# EAGLE schematic usb_tester (EAGLE 6.3)
TITLE: USB TESTER
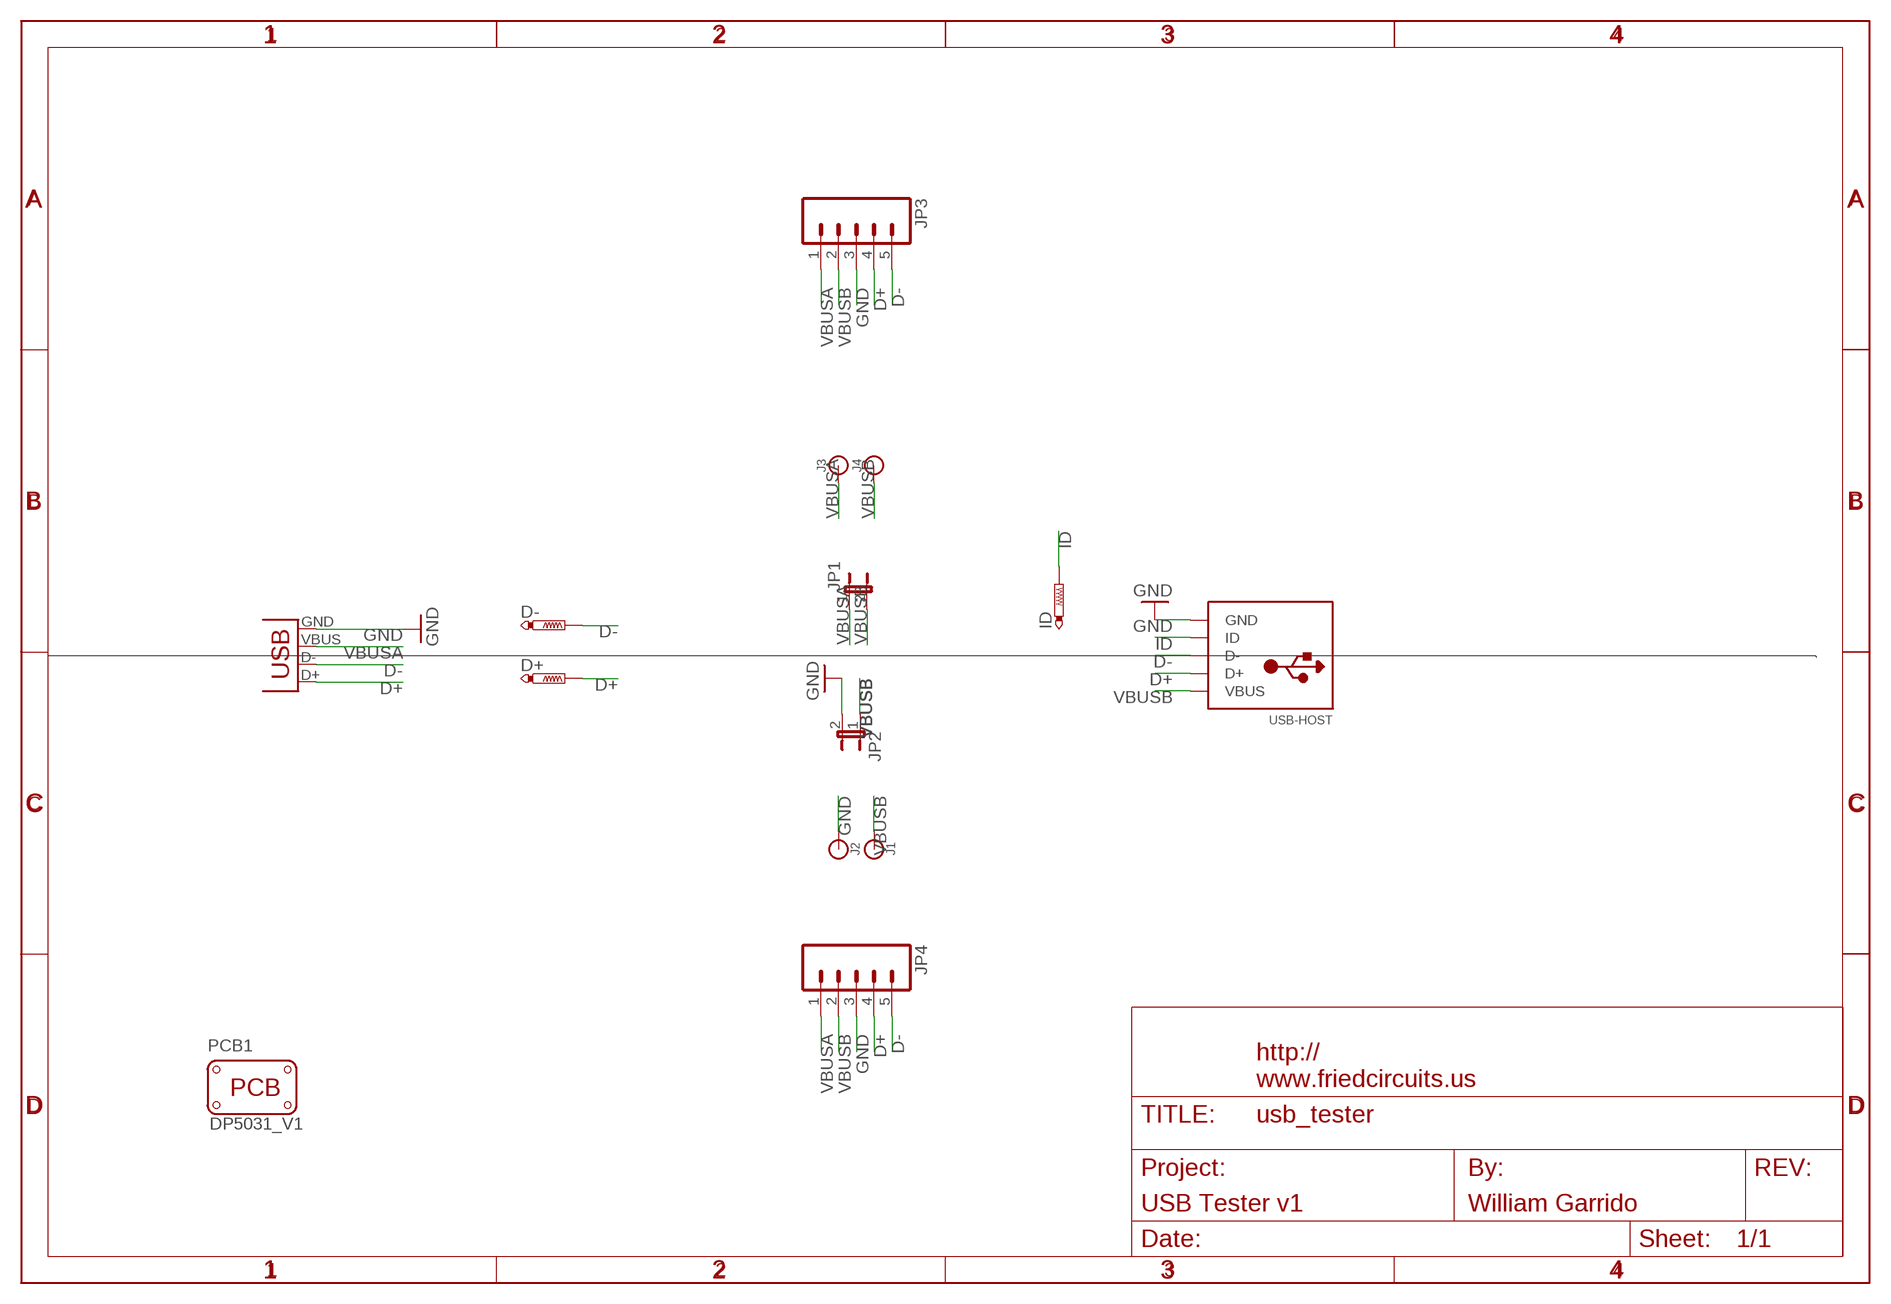
[diagram p0: schematic, sheet 1]

## Parts
D+  PTR1PAD1-20  [P1-20]
D-  PTR1PAD1-20  [P1-20]
ID  PTR1PAD1-20  [P1-20]
J1  BANANA_CONN  [BANANA_CONN]
J2  BANANA_CONN  [BANANA_CONN]
J3  BANANA_CONN  [BANANA_CONN]
J4  BANANA_CONN  [BANANA_CONN]
JP1  JUMPER-2PTH_LOCK  [1X02_LOCK]
JP2  JUMPER-2PTH_LOCK  [1X02_LOCK]
JP3  M05LOCK  [1X05_LOCK]
JP4  M05LOCK  [1X05_LOCK]
PCB1  PCB_DP_RECTANGLE-31X50  [DP5031_V1]
U$1  FRAME_DINA4_L  [FC_CREDIT]
USB-DEVICE  USB-A-SMD  [USB-A-S-NOSILK-FEMALE]
USB-HOST  USBMINIB  [USB-MINIB]

## Nets
D+: D+.TP JP3.4 JP4.4 USB-DEVICE.D+ USB-HOST.D+
D-: D-.TP JP3.5 JP4.5 USB-DEVICE.D- USB-HOST.D-
GND: J2.P$1 JP2.2 JP3.3 JP4.3 USB-DEVICE.GND USB-HOST.GND
ID: ID.TP USB-HOST.ID
VBUSA [VBUS]: J3.P$1 JP1.1 JP3.1 JP4.1 USB-DEVICE.VBUS
VBUSB [VBUS]: J1.P$1 J4.P$1 JP1.2 JP2.1 JP3.2 JP4.2 USB-HOST.VBUS

## Library data of the parts
D+ D- ID = testpad:PTR1: TEST PIN
J1-J4 = SparkFun-Connectors:BANANA_CONN: Through-hole banana jack
JP1 JP2 = SparkFun-Passives:JUMPER-2: Jumper Basic 0.1" spaced jumper. Use with breakaway headers.
JP3 JP4 = SparkFun-Connectors:M05: Header 5 Standard 5-pin 0.1" header. Use with straight break away headers (SKU : PRT-00116), right angle break away headers (PRT-00553), swiss pins (PRT-00743), machine pins (PRT-00117), and female headers (PRT-00115). Molex polarized connector foot print use with SKU : PRT-08230 with associated crimp pins and housings.
PCB1 = dp_devices:PCB_DP_RECTANGLE: Dangerous Prototypes Standard Rectangular PCB sizes; PCB_SIZE: DP5031_V1
U$1 = FriedCircuits:FRAME_DINA4_L: A4 FC frame Standard FriedCircuits schematic frame. Automagically adds the standard texts to the PCB Use the atrribute in the schematic editor to change the fields.; AUTHOR: William Garrido; FF1: fulfillment by; FF2: FriedCircuits; FF3: www.friedcircuits.us; PROJECT: USB Tester v1; URL1: http://; URL2: www.friedcircuits.us
USB-DEVICE = SparkFun-Connectors:USB: USB Connectors USB-B-PTH is fully proven SKU : PRT-00139/CONN-08278 USB-miniB is fully proven SKU : PRT-00587 USB-A-PCB is untested. USB-A-H is throughly reviewed, but untested. Spark Fun Electronics SKU : PRT-00437 USB-B-SMT is throughly reviewed, but untested. Needs silkscreen touching up. USB-A-S has not been used/tested USB-MB-H has not been used/tested USB-MICROB has been used. CONN-09505; PROD_ID: CONN-09520
USB-HOST = adafruit:USB: USB Connectors USBMINIB - Surface Mount Female Mini-B USB Connector 4UConnector: 06564 By microbuilder.eu Thru-hole RA Female Mini-B USB Connector 4UConnector: 18732 By ladyada.net

## Net classes
0 default: width 0.254 mm, drill 0.254 mm
1 VBUS: width 0.61 mm, drill 0.254 mm